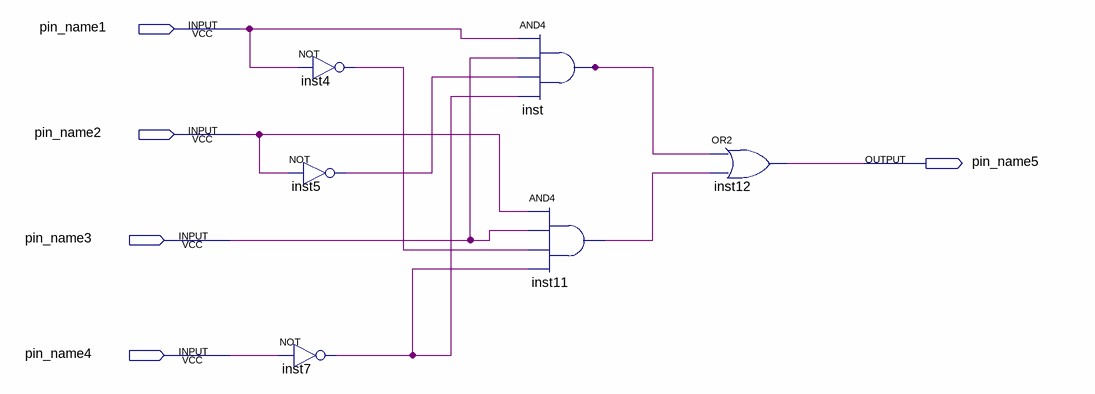
[diagram p0: schematic sheet]
// Quartus schematic b (2022_05_22 18_19_10 UTC).bdf as structural Verilog: 6 symbols, 5 pins
module \b_(2022_05_22_18_19_10_UTC)  (
  input  pin_name1,
  input  pin_name2,
  input  pin_name3,
  input  pin_name4,
  output pin_name5
);

  wire inst4_out, inst5_out, inst7_out, inst11_out, inst_out;

  not inst4 (inst4_out, pin_name1);
  not inst5 (inst5_out, pin_name2);
  not inst7 (inst7_out, pin_name4);
  and inst (inst_out, pin_name1, pin_name3, inst5_out, inst7_out);
  and inst11 (inst11_out, pin_name2, pin_name3, inst4_out, inst7_out);
  or inst12 (pin_name5, inst_out, inst11_out);
endmodule
